# EAGLE schematic E75-2G4M20S-BEE-1.1 (EAGLE 9.2.2)
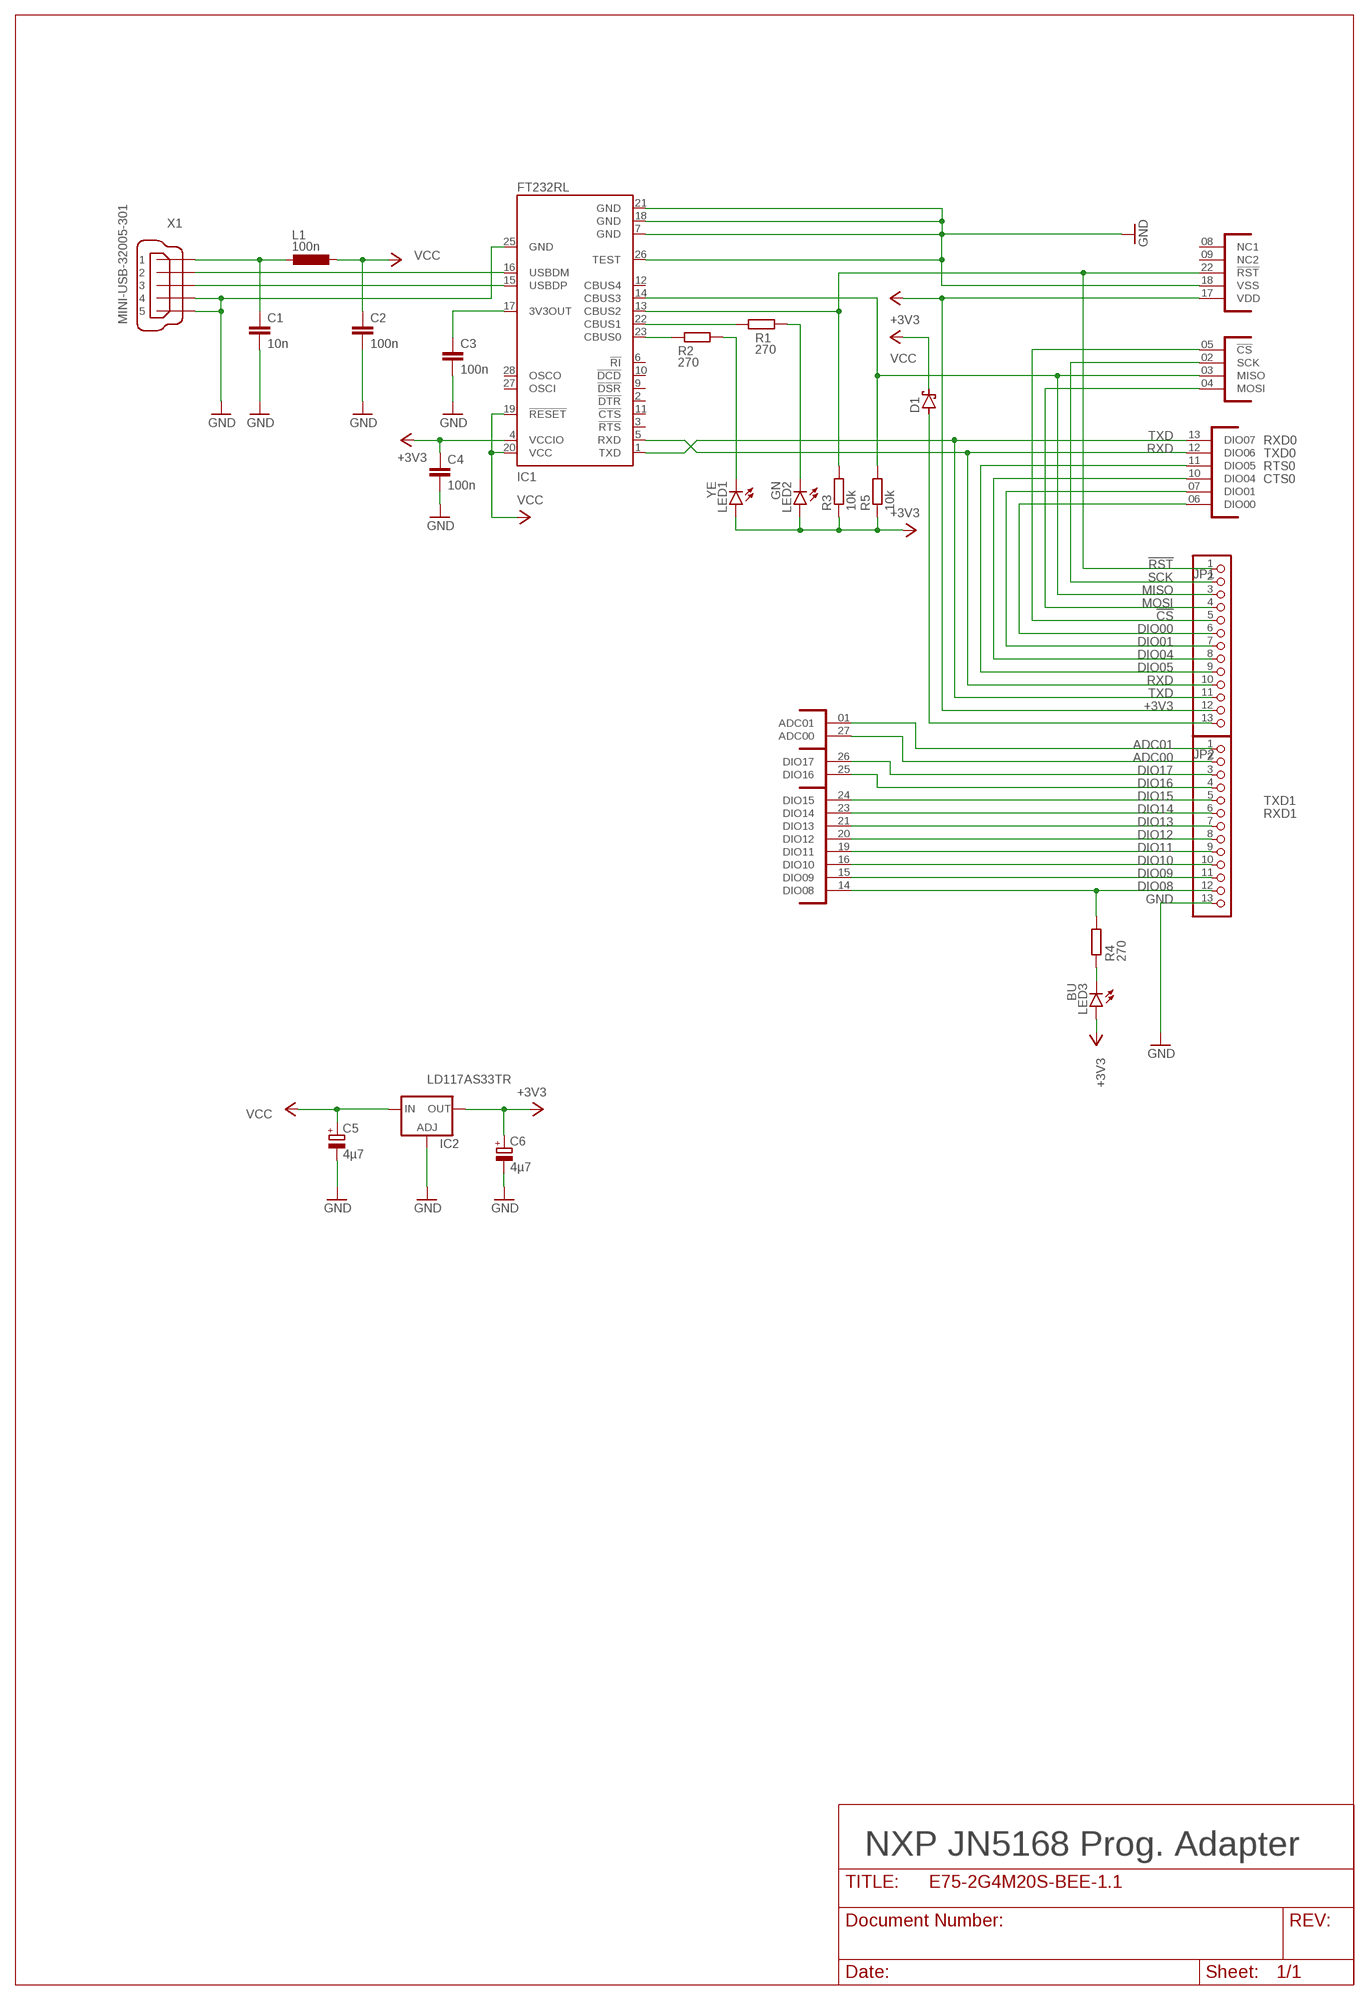
[diagram p0: schematic, sheet 1]

## Parts
C1  10n  C-EUC0805  [C0805]
C2  100n  C-EUC0805  [C0805]
C3  100n  C-EUC0805  [C0805]
C4  100n  C-EUC0805  [C0805]
C5  4µ7  CPOL-EUSMCB  [SMC_B]
C6  4µ7  CPOL-EUSMCB  [SMC_B]
D1  SCHOTTKY-DIODESMD  [SMB]
IC1  FT232RL  [SSOP28]
IC2  LD117AS33TR  [SOT223]
JP1  PINHD-1X13  [1X13]
JP2  PINHD-1X13  [1X13]
L1  100n  L-EUL3225P  [L3225P]
LED1  YE  LEDCHIP-LED0805  [CHIP-LED0805]
LED2  GN  LEDCHIP-LED0805  [CHIP-LED0805]
LED3  BU  LEDCHIP-LED0805  [CHIP-LED0805]
N1  E75-2G4M20S  [E75-2G4M20S]
R1  270  R-EU_R0805W  [R0805W]
R2  270  R-EU_R0805W  [R0805W]
R3  10k  R-EU_M0805  [M0805]
R4  270  R-EU_R0805W  [R0805W]
R5  10k  R-EU_M0805  [M0805]
X1  MINI-USB-32005-301  [32005-301]

## Nets
!CS: JP1.5 N1.05(SPI:!CS)
!RST: IC1.13(CBUS2) JP1.1 N1.22(SUPPLY:!RST) R3.2
+3V3: C4.1 C6.+ IC1.4(VCCIO) IC2.4(OUT) JP1.12 LED1.A LED2.A LED3.A N1.17(SUPPLY:VDD) R3.1 R5.1
ADC00: JP2.2 N1.27(ADC:ADC00)
ADC01: JP2.1 N1.01(ADC:ADC01)
DIO00: JP1.6 N1.06(DIO1:DIO00)
DIO01: JP1.7 N1.07(DIO1:DIO01)
DIO04: JP1.8 N1.10(DIO1:DIO04)
DIO05: JP1.9 N1.11(DIO1:DIO05)
DIO08: JP2.12 N1.14(DIO2:DIO08) R4.2
DIO09: JP2.11 N1.15(DIO2:DIO09)
DIO10: JP2.10 N1.16(DIO2:DIO10)
DIO11: JP2.9 N1.19(DIO2:DIO11)
DIO12: JP2.8 N1.20(DIO2:DIO12)
DIO13: JP2.7 N1.21(DIO2:DIO13)
DIO14: JP2.6 N1.23(DIO2:DIO14)
DIO15: JP2.5 N1.24(DIO2:DIO15)
DIO16: JP2.4 N1.25(DIO3:DIO16)
DIO17: JP2.3 N1.26(DIO3:DIO17)
DM: IC1.16(USBDM) X1.2
DP: IC1.15(USBDP) X1.3
GND: C1.2 C2.2 C3.2 C4.2 C5.- C6.- IC1.7(GND) IC1.18(GND) IC1.21(GND) IC1.25(GND) IC1.26(TEST) IC2.1(ADJ) JP2.13 N1.18(SUPPLY:VSS) X1.4 X1.5
MISO: IC1.14(CBUS3) JP1.3 N1.03(SPI:MISO) R5.2
MOSI: JP1.4 N1.04(SPI:MOSI)
N$1: C3.1 IC1.17(3V3OUT)
N$2: LED3.C R4.1
N$3: C1.1 L1.2 X1.1
N$4: IC1.23(CBUS0) R2.1
N$5: D1.A JP1.13
N$13: IC1.22(CBUS1) R1.1
N$14: LED1.C R2.2
N$15: LED2.C R1.2
RXD: IC1.5(RXD) JP1.10 N1.12(DIO1:DIO06)
SCK: JP1.2 N1.02(SPI:SCK)
TXD: IC1.1(TXD) JP1.11 N1.13(DIO1:DIO07)
VCC: C2.1 C5.+ D1.C IC1.19(!RESET) IC1.20(VCC) IC2.3(IN) L1.1
Unconnected: IC1.2(!DTR) IC1.3(!RTS) IC1.6(!RI) IC1.9(!DSR) IC1.10(!DCD) IC1.11(!CTS) IC1.12(CBUS4) IC1.27(OSCI) IC1.28(OSCO) N1.08(SUPPLY:NC1) N1.09(SUPPLY:NC2)

## Notes on the sheet
- RXD0
- TXD0
- RTS0
- CTS0
- TXD1
- RXD1
- NXP JN5168 Prog. Adapter

## Library data of the parts
C1-C4 = rcl:C-EU: CAPACITOR, European symbol; SPICEPREFIX: C
C5 C6 = rcl:CPOL-EU: POLARIZED CAPACITOR, European symbol; SPICEPREFIX: C
D1 = diode:SCHOTTKY-DIODE: Schottky Diode
IC1 = ftdichip:FT232R: Source: http://www.ftdichip.com/Documents/DataSheets/DS_FT232R_v104.pdf; MPN: FT232RL; OC_FARNELL: 1146032; OC_NEWARK: 91K9918
IC2 = v-reg:LD117A?*: Low drop fixed and adjustable positive voltage regulators 1 A Source: http://www.st.com/stonline/products/literature/ds/7194/ld1117axx.pdf
JP1 JP2 = pinhead:PINHD-1X13: PIN HEADER
L1 = rcl:L-EU: INDUCTOR, European symbol; SPICEPREFIX: L
LED1-LED3 = led:LED: LED OSRAM: - CHIPLED LG R971, LG N971, LY N971, LG Q971, LY Q971, LO R971, LY R971 LH N974, LH R974 LS Q976, LO Q976, LY Q976 LO Q996 - Hyper CHIPLED LW Q18S LB Q993, LB Q99A, LB R99A - SideLED LS A670, LO A670, LY A670, LG A670, LP A670 LB A673, LV A673, LT A673, LW A673 LH A674 LY A675 LS A676, LA A676, LO A676, LY A676, LW A676 LS A679, LY A679, LG A679 - Hyper Micro SIDELED® LS Y876, LA Y876, LO Y876, LY Y876 LT Y87S - SmartLED LW L88C, LW L88S LB L89C, LB L89S, LG L890 LS L89K, LO L89K, LY L89K LS L896, LA L896, LO L896, LY L896 - TOPLED LS T670, LO T670, LY T670, LG T670, LP T670 LSG T670, LSP T670, LSY T670, LOP T670, LYG T670 LG T671, LOG T671, LSG T671 LB T673, LV T673, LT T673, LW T673 LH T674 LS T676, LA T676, LO T676, LY T676, LB T676, LH T676, LSB T676, LW T676 LB T67C, LV T67C, LT T67C, LS T67K, LO T67K, LY T67K, LW E67C LS E67B, LA E67B, LO E67B, LY E67B, LB E67C, LV E67C, LT E67C LW T67C LS T679, LY T679, LG T679 LS T770, LO T770, LY T770, LG T770, LP T770 LB T773, LV T773, LT T773, LW T773 LH T774 LS E675, LA E675, LY E675, LS T675 LS T776, LA T776, LO T776, LY T776, LB T776 LHGB T686 LT T68C, LB T68C - Hyper Mini TOPLED® LB M676 - Mini TOPLED Santana® LG M470 LS M47K, LO M47K, LY M47K Source: http://www.osram.convergy.de LUXEON: - LUMILED® LXK2-PW12-R00, LXK2-PW12-S00, LXK2-PW14-U00, LXK2-PW14-V00 LXK2-PM12-R00, LXK2-PM12-S00, LXK2-PM14-U00 LXK2-PE12-Q00, LXK2-PE12-R00, LXK2-PE12-S00, LXK2-PE14-T00, LXK2-PE14-U00 LXK2-PB12-K00, LXK2-PB12-L00, LXK2-PB12-M00, LXK2-PB14-N00, LXK2-PB14-P00, LXK2-PB14-Q00 LXK2-PR12-L00, LXK2-PR12-M00, LXK2-PR14-Q00, LXK2-PR14-R00 LXK2-PD12-Q00, LXK2-PD12-R00, LXK2-PD12-S00 LXK2-PH12-R00, LXK2-PH12-S00 LXK2-PL12-P00, LXK2-PL12-Q00, LXK2-PL12-R00 Source: www.luxeon.com KINGBRIGHT: KA-3528ASYC Source: www.kingbright.com
N1 = RF-Adapters:E75-2G4M20S
R1-R5 = rcl:R-EU_: RESISTOR, European symbol; SPICEPREFIX: R
X1 = con-cypressindustries:MINI-USB-: MINI USB-B Conector Source: www.cypressindustries.com; OC_FARNELL: unknown; OC_NEWARK: unknown